# EAGLE schematic SchematZasilanie (EAGLE 9.7.0)
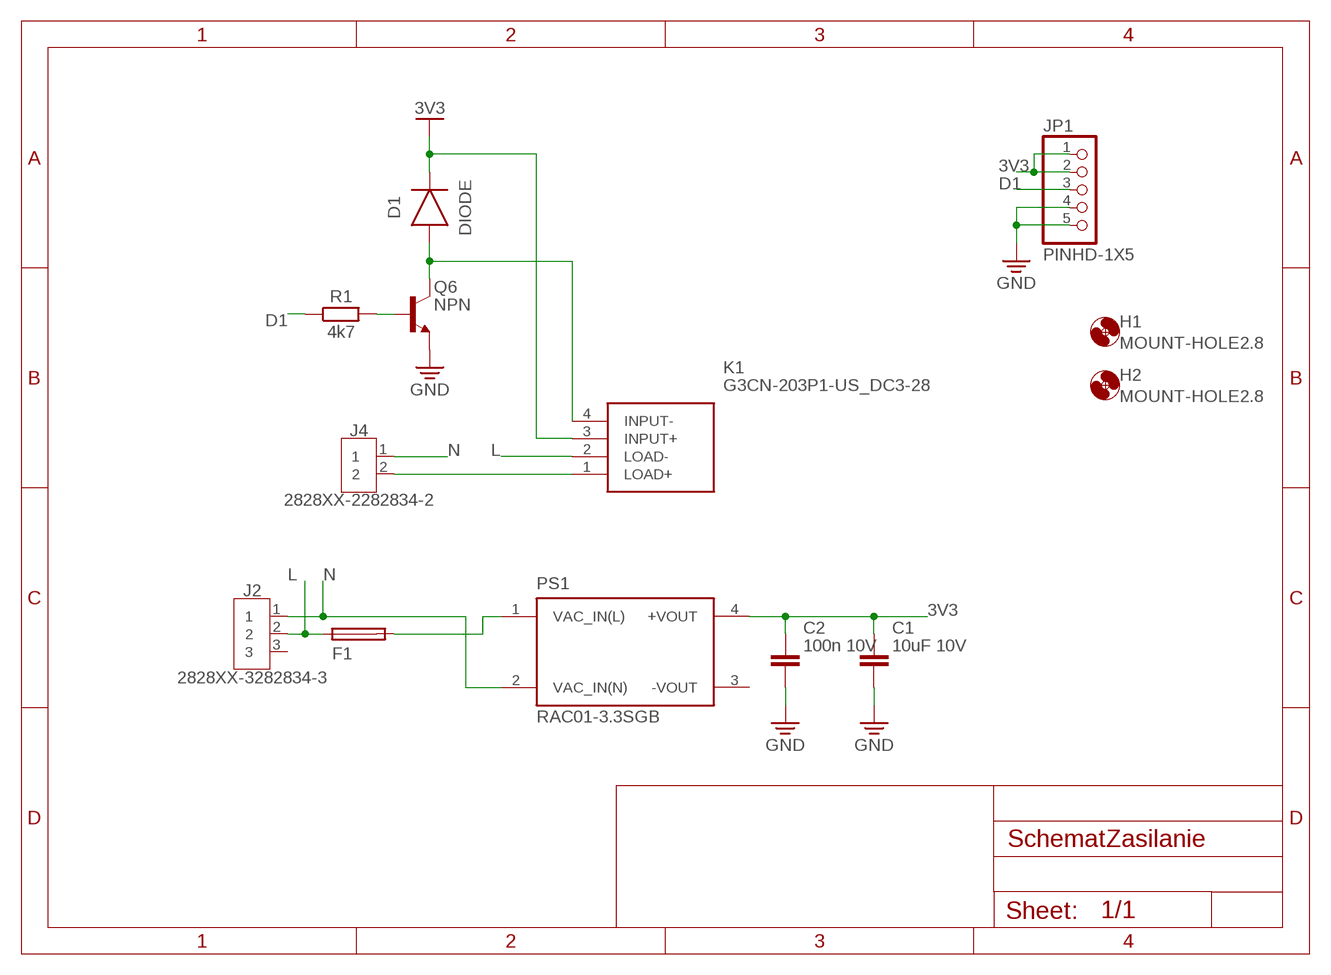
[diagram p0: schematic, sheet 1]

## Parts
C1  10uF 10V  C_CHIP-1206(3216-METRIC)  [CAPC3216X135]
C2  100n 10V  C_CHIP-1206(3216-METRIC)  [CAPC3216X135]
D1  DIODE  DIODE_DO-213AA(SOD-80)  [DIOMELF3516]
F1  FUSE_CHIP-1206(3216-METRIC)  [FUSC3215X82N]
H1  MOUNT-HOLE2.8  [2,8]
H2  MOUNT-HOLE2.8  [2,8]
J2  2828XX-3282834-3  [TERMBLK_254-3N]
J4  2828XX-2282834-2  [TERMBLK_254-2N]
JP1  PINHD-1X5  [1X05]
K1  G3CN-203P1-US_DC3-28  [G3CN203P1USDC328]
PS1  RAC01-3.3SGB  [CONV_RAC01-3.3SGB]
Q6  NPN  NPN_TO18-EBC  [TO18]
R1  4k7  R_CHIP-0603(1608-METRIC)  [RESC1608X60]

## Nets
3V3: C1.1 C2.1 D1.1(C) JP1.1 JP1.2 K1.3(INPUT+) PS1.4(+VOUT)
D1: JP1.3 R1.1
GND: C1.2 C2.2 JP1.4 JP1.5 Q6.1(E)
L: F1.1 J2.2 K1.2(LOAD-)
N: J2.1 J4.1 PS1.2(VAC_IN(N))
N$1: J4.2 K1.1(LOAD+)
N$2: F1.2 PS1.1(VAC_IN(L))
N$3: Q6.2(B) R1.2
N$5: D1.2(A) K1.4(INPUT-) Q6.3(C)
Unconnected: J2.3 PS1.3(-VOUT)

## Library data of the parts
C1 C2 = Capacitor:C: Capacitor - Generic; CATEGORY: Capacitor
D1 = Diode:DIODE: Diode Rectifier - Generic; CATEGORY: Diode; SUB-CATEGORY: Rectifier
F1 = Circuit-Protection:FUSE: Fuse - Generic; CATEGORY: Circuit-Protection; SUB-CATEGORY: Fuse
H1 H2 = holes:MOUNT-HOLE: MOUNTING HOLE with drill center marker
J2 = Connector:2828XX-3: 3 Position Wire to Board Terminal Block Horizontal with Board Datasheet <https://www.te.com.cn/commerce/DocumentDelivery/DDEController?Action=showdoc&DocId=Catalog+Section%7F1308389_EUROSTYLE_TERMINAL_BLOCKS%7F0607%7Fpdf%7FEnglish%7FENG_CS_1308389_EUROSTYLE_TERMINAL_BLOCKS_0607.pdf%7F2-282837-5>; CATEGORY: Fixed Terminal Blocks; DESCRIPTION: Fixed Terminal Blocks 3P TERMINAL BLOCK; MANUFACTURER: TE Connectivity AMP Connectors; MPN: 282834-3; OPERATING_TEMPERATURE: -40°C ~ 105°C; PART_STATUS: Active; PITCH: 0.100" (2.54mm); ROHS_COMPLIANCE: RoHS Compliant; SERIES: Buchanan; SUBCATEGORY: Terminal Blocks; TYPE: Through Hole; Screw - Rising Cage Clamp; Side wire entry, Horizontal with Board
J4 = Connector:2828XX-2: 2 Position Wire to Board Terminal Block Horizontal with Board Datasheet <https://www.te.com.cn/commerce/DocumentDelivery/DDEController?Action=showdoc&DocId=Catalog+Section%7F1308389_EUROSTYLE_TERMINAL_BLOCKS%7F0607%7Fpdf%7FEnglish%7FENG_CS_1308389_EUROSTYLE_TERMINAL_BLOCKS_0607.pdf%7F2-282837-5>; CATEGORY: Fixed Terminal Blocks; DESCRIPTION: Fixed Terminal Blocks 2P SIDE ENTRY 2.54mm; MANUFACTURER: TE Connectivity AMP Connectors; MPN: 282834-2; OPERATING_TEMPERATURE: -40°C ~ 105°C; PART_STATUS: Active; PITCH: 0.100" (2.54mm); ROHS_COMPLIANCE: RoHS Compliant; SERIES: Buchanan; SUBCATEGORY: Terminal Blocks; TYPE: Through Hole; Screw - Rising Cage Clamp; Side wire entry, Horizontal with Board
JP1 = Connector:PINHD-1X5: PIN HEADER; CATEGORY: Headers; DESCRIPTION: Header, Straight, 5 Position; MANUFACTURER: Generic; MPN: Generic; OPERATING_TEMPERATURE: Generic; PART_STATUS: Active; PITCH: 0.100" (2.54mm); ROHS_COMPLIANCE: Generic; SERIES: Generic; SUB-CATEGORY: Headers, Male Pins; TYPE: Board to Board or Cable, Unshrouded, Through Hole, Straight
K1 = SamacSys_Parts:G3CN-203P1-US_DC3-28: Solid State Relays - PCB Mount SOLID STATE RELAY Source: Datasheet <https://www.fa.omron.co.jp/data_pdf/cat/g3cn_ds_j_1_10.pdf?id=2811>; DESCRIPTION: Solid State Relays - PCB Mount SOLID STATE RELAY; HEIGHT: 28mm; MANUFACTURER_NAME: Omron Electronics; MANUFACTURER_PART_NUMBER: G3CN-203P1-US DC3-28; MOUSER_PART_NUMBER: 653-G3CN203P1USDC328; MOUSER_PRICE-STOCK: https://www.mouser.co.uk/ProductDetail/Omron-Automation-and-Safety/G3CN-203P1-US-DC3-28?qs=fQQAKcphggreI%2F4dLh%252B1pA%3D%3D
PS1 = Biblioteka:RAC01-3.3SGB: AC/DC Converter, 1 Watt, Single Output, EMC Class B Check availability <https://pricing.snapeda.com/parts/RAC01-05SGB/Recom%20Power/view-part?ref=eda>; AVAILABILITY: In Stock; CHECK_PRICES: https://www.snapeda.com/parts/RAC01-05SGB/Recom+Power/view-part/?ref=eda; DESCRIPTION: AC-DC, Converter, 3kV reg, Single Output, 1W, 5V Out, RAC01-GB Series | RECOM Power Inc. RAC01-05SGB; MF: Recom Power; MP: RAC01-05SGB; PACKAGE: DIP-4 Recom Power; PRICE: None; SNAPEDA_LINK: https://www.snapeda.com/parts/RAC01-05SGB/Recom+Power/view-part/?ref=snap
Q6 = Transistor:NPN: NPN - Generic; CATEGORY: Transistor; SUB-CATEGORY: BJT; TYPE: NPN
R1 = Resistor:R: Resistor Fixed - Generic; CATEGORY: Resistor; SUB-CATEGORY: Fixed